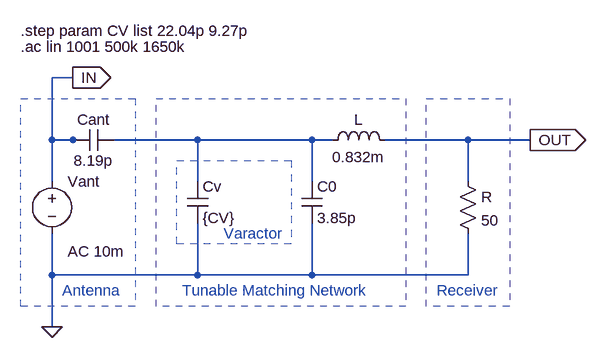
[diagram p0: schematic Task1_1493_McDade.asc]
Task1_1493_McDade.asc, the LTspice schematic file:
Version 4
SHEET 1 1032 996
WIRE -992 80 -1024 80
WIRE -1024 176 -1024 80
WIRE -992 176 -1024 176
WIRE -976 176 -992 176
WIRE -800 176 -928 176
WIRE -624 176 -800 176
WIRE -592 176 -624 176
WIRE -384 176 -512 176
WIRE -288 176 -384 176
WIRE -1024 240 -1024 176
WIRE -800 240 -800 176
WIRE -624 240 -624 176
WIRE -384 240 -384 176
WIRE -1024 384 -1024 320
WIRE -800 384 -800 304
WIRE -800 384 -1024 384
WIRE -624 384 -624 304
WIRE -624 384 -800 384
WIRE -384 384 -384 320
WIRE -384 384 -624 384
WIRE -1024 464 -1024 384
FLAG -1024 464 0
FLAG -288 176 OUT
IOPIN -288 176 Out
FLAG -992 80 IN
IOPIN -992 80 Out
SYMBOL voltage -1024 224 R0
WINDOW 3 24 152 Invisible 2
WINDOW 123 24 124 Left 2
WINDOW 39 0 0 Left 2
SYMATTR Value 0
SYMATTR Value2 AC 10m
SYMATTR InstName Vant
SYMBOL cap -928 160 R90
WINDOW 0 0 32 VBottom 2
WINDOW 3 32 32 VTop 2
SYMATTR InstName Cant
SYMATTR Value 8.19p
SYMBOL cap -640 240 R0
SYMATTR InstName C0
SYMATTR Value 3.85p
SYMBOL res -400 224 R0
SYMATTR InstName R
SYMATTR Value 50
SYMBOL cap -816 240 R0
SYMATTR InstName Cv
SYMATTR Value {CV}
SYMBOL ind -608 192 R270
WINDOW 0 32 56 VTop 2
WINDOW 3 5 56 VBottom 2
SYMATTR InstName L
SYMATTR Value 0.832m
TEXT -1072 32 Left 2 !.ac lin 1001 500k 1650k
TEXT -1072 8 Left 2 !.step param CV list 22.04p 9.27p
TEXT -1008 408 Left 2 ;Antenna
TEXT -432 408 Left 2 ;Receiver
TEXT -760 320 Left 2 ;Varactor
TEXT -824 408 Left 2 ;Tunable Matching Network
RECTANGLE Normal -896 432 -1072 112 2
RECTANGLE Normal -320 432 -448 112 2
RECTANGLE Normal -832 208 -656 336 2
RECTANGLE Normal -864 112 -480 432 2

The netlist it stands for:
* Task1_1493_McDade.asc
Vant IN 0 0 AC 10m
Cant N001 IN 8.19p
C0 N001 0 3.85p
R OUT 0 50
Cv N001 0 {CV}
L N001 OUT 0.832m
.ac lin 1001 500k 1650k
.step param CV list 22.04p 9.27p
* Antenna
* Receiver
* Varactor
* Tunable Matching Network
.backanno
.end